# EAGLE design amiketo_2hm (EAGLE 7.2.0)
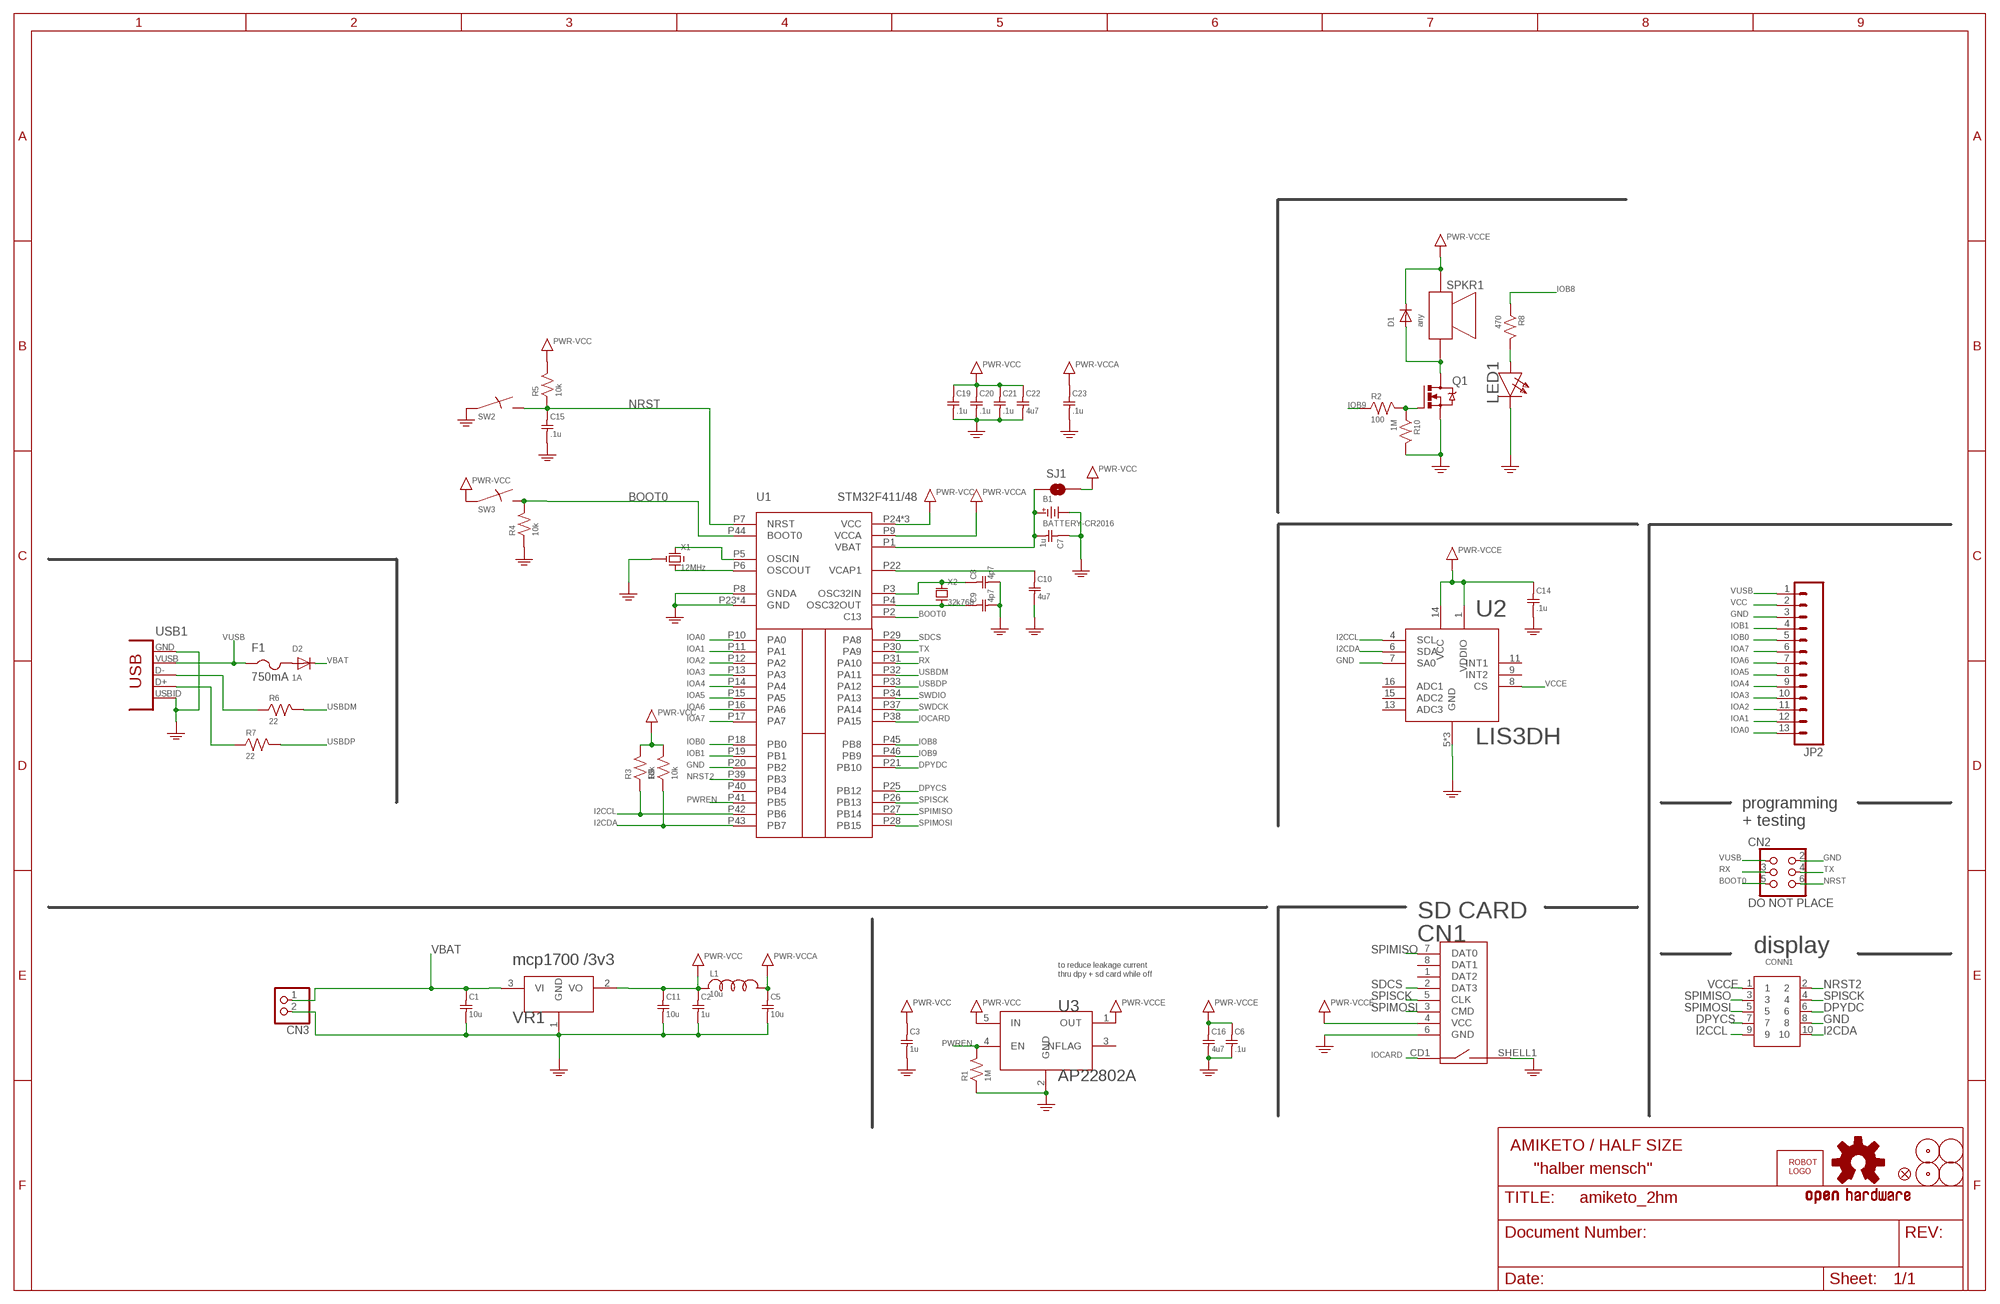
[diagram p0: schematic, sheet 1]

## Parts
B1  BATTERY-CR2016  [CR1216]
C1  10u  C0603  [SMD0603]
C2  1u  C0603  [SMD0603]
C3  1u  C0603  [SMD0603]
C5  10u  C0603  [SMD0603]
C6  .1u  C0603  [SMD0603]
C7  1u  C0603  [SMD0603]
C8  4p7  C0603  [SMD0603]
C9  4p7  C0603  [SMD0603]
C10  4u7  C0603  [SMD0603]
C11  10u  C0603  [SMD0603]
C14  .1u  C0603  [SMD0603]
C15  .1u  C0603  [SMD0603]
C16  4u7  C0603  [SMD0603]
C19  .1u  C0603  [SMD0603]
C20  .1u  C0603  [SMD0603]
C21  .1u  C0603  [SMD0603]
C22  4u7  C0603  [SMD0603]
C23  .1u  C0603  [SMD0603]
CN1  MICROSD-EJECT  [MICROSD/EJECTOR]
CN2  DO NOT PLACE  HEADER-3X2-POGO  [HEADER-3X2-POGO]
CN3  JST_2PIN-SMT-RA  [JST-PH-2-SMT-RA]
CONN1  HEADER-5X2-PTH  [HEADER-5X2-PTH]
D1  any  DIODE-0805  [SMD0805D]
D2  1A  DIODE-0805  [SMD0805D]
F1  750mA  FUSE  [SMD1206]
JP2  M13  [1X13]
L1  10u  LSMD0603  [SMD0603]
LED1  white  LED  [SMD0603D]
LOGO1  OSHW-LOGOM  [OSHW-LOGO-M]
Q1  IRLML6344TRPBF  MOSFETSOT-23  [SOT-23]
R1  1M  R0603  [SMD0603]
R2  100  R0603  [SMD0603]
R3  10k  R0603  [SMD0603]
R4  10k  R0603  [SMD0603]
R5  10k  R0603  [SMD0603]
R6  22  R0603  [SMD0603]
R7  22  R0603  [SMD0603]
R8  470  R0603  [SMD0603]
R9  10k  R0603  [SMD0603]
R10  1M  R0603  [SMD0603]
SJ1  JUMPER-PAD-2-NOYES_SILK  [PAD-JUMPER-2-NO_YES_SILK]
SPKR1  PUI-5040  [PUI-0540]
SW2  SWITCHKMR211  [KMR211]
SW3  SWITCHKMR211  [KMR211]
U1  STM32F411/48  [UQPFN48]
U2  LIS3DH  [LGA16A]
U3  AP22802A  NCP380  [SOT-23-5]
U$1  FIDUCIAL  [FIDUCIAL]
U$2  FIDUCIAL  [FIDUCIAL_1MM]
U$3  FIDUCIAL  [FIDUCIAL_1MM]
U$4  ROBOTMAN-LOGO2  [ROBOTMAN-LOGO2]
U$5  FIDUCIAL  [FIDUCIAL]
U$6  FIDUCIALUFIDUCIAL  [MICRO-FIDUCIAL]
USB1  CON-USB-F-MICRO-B  [CONN_USB_MICRO-B]
VR1  mcp1700 /3v3  REGULATOR-SOT23-3  [SOT-23-3]
X1  12MHz  RESONATORCTCE  [RESONATOR-CSTCE]
X2  32k768  XTAL32X15  [XTAL-32X15]

## Nets
BOOT0: CN2.5 R4.2 SW3.2 SW3.4 U1.P2(C13) U1.P44(BOOT0)
DPYCS: CONN1.7 U1.P25(PB12)
DPYDC: CONN1.6 U1.P21(PB10)
GND: B1.MINUS(M) C1.2 C2.2 C3.2 C5.2 C6.2 C7.1 C8.2 C9.2 C10.2 C11.2 C14.2 C15.2 C16.2 C19.2 C20.2 C21.2 C22.2 C23.2 CN1.6(GND) CN1.SHELL1(SW2) CN2.2 CN3.2 CONN1.8 JP2.3 LED1.C Q1.2(S) R1.1 R4.1 R10.2 SW2.1 SW2.3 U1.P8(GNDA) U1.P20(PB2) U1.P23(GND) U1.P35(GND) U1.P47(GND) U1.PAD(GND) U2.5(GND) U2.7(SA0) U2.10(GND) U2.12(GND) U3.2(GND) USB1.P4(USBID) USB1.P5(GND) VR1.1(GND) X1.2(G) ; supply symbol labelled PWR-GND
I2CCL: CONN1.9 R3.1 U1.P42(PB6) U2.4(SCL)
I2CDA: CONN1.10 R9.1 U1.P43(PB7) U2.6(SDA)
IOA0: JP2.13 U1.P10(PA0)
IOA1: JP2.12 U1.P11(PA1)
IOA2: JP2.11 U1.P12(PA2)
IOA3: JP2.10 U1.P13(PA3)
IOA4: JP2.9 U1.P14(PA4)
IOA5: JP2.8 U1.P15(PA5)
IOA6: JP2.7 U1.P16(PA6)
IOA7: JP2.6 U1.P17(PA7)
IOB0: JP2.5 U1.P18(PB0)
IOB1: JP2.4 U1.P19(PB1)
IOB8: R8.1 U1.P45(PB8)
IOB9: R2.1 U1.P46(PB9)
IOCARD: CN1.CD1(SW1) U1.P38(PA15)
N$7: R6.1 USB1.P2(D-)
N$8: R7.1 USB1.P3(D+)
N$9: Q1.1(G) R2.2 R10.1
N$11: LED1.A R8.2
N$12: U1.P5(OSCIN) X1.1(X1)
N$13: U1.P6(OSCOUT) X1.3(X2)
N$14: D1.A Q1.3(D) SPKR1.P2
N$15: C8.1 U1.P3(OSC32IN) X2.P$1
N$16: C9.1 U1.P4(OSC32OUT) X2.P$2
N$18: C10.1 U1.P22(VCAP1)
N$21: B1.PLUS1(P) B1.PLUS2(P) C7.2 SJ1.1 U1.P1(VBAT)
N$24: D2.A F1.2
NRST: C15.1 CN2.6 R5.1 SW2.2 SW2.4 U1.P7(NRST)
NRST2: CONN1.2 U1.P39(PB3)
PWREN: R1.2 U1.P41(PB5) U3.4(EN)
RX: CN2.3 U1.P31(PA10)
SDCS: CN1.2(DAT3) U1.P29(PA8)
SPIMISO: CN1.7(DAT0) CONN1.3 U1.P27(PB14)
SPIMOSI: CN1.3(CMD) CONN1.5 U1.P28(PB15)
SPISCK: CN1.5(CLK) CONN1.4 U1.P26(PB13)
SWDCK: U1.P37(PA14)
SWDIO: U1.P34(PA13)
TX: CN2.4 U1.P30(PA9)
USBDM: R6.2 U1.P32(PA11)
USBDP: R7.2 U1.P33(PA12)
VBAT: C1.1 CN3.1 D2.C VR1.3(VI)
VCC: C2.1 C3.1 C11.1 C19.1 C20.1 C21.1 C22.1 JP2.2 L1.1 R3.2 R5.2 R9.2 SJ1.2 SW3.1 SW3.3 U1.P24(VCC) U1.P36(VCC) U1.P48(VCC) U3.5(IN) VR1.2(VO) ; supply symbol labelled PWR-VCC
VCCA: C5.1 C23.1 L1.2 U1.P9(VCCA) ; supply symbol labelled PWR-VCCA
VCCE: C6.1 C14.1 C16.1 CN1.4(VCC) CONN1.1 D1.C SPKR1.P1 U2.1(VDDIO) U2.8(CS) U2.14(VCC) U3.1(OUT) ; supply symbol labelled PWR-VCCE
VUSB: CN2.1 F1.1 JP2.1 USB1.P1(VUSB)
Unconnected: CN1.1(DAT2) CN1.8(DAT1) U1.P40(PB4) U2.9(INT2) U2.11(INT1) U2.13(ADC3) U2.15(ADC2) U2.16(ADC1) U3.3(NFLAG) USB1.BODY@1(BODY) USB1.BODY@2(BODY) USB1.BODY@3(BODY) USB1.BODY@4(BODY)

## Notes on the sheet
- programming
  + testing
- SD CARD
- display
- to reduce leakage current
  thru dpy + sd card while off
- AMIKETO / HALF SIZE
- "halber mensch"

## Library data of the parts
B1 = jaw:BATTERY
C1-C3 C5-C11 C14-C16 C19-C23 = jaw:C
CN1 = jaw:MICROSD
CN2 = jaw:HEADER-3X2
CN3 = adafruit:JST_2PIN: JST 2-Pin Connectors of various flavors SMT-RA (S2B-PH-SM4) 4UConnector #17311 SMT (B2B-PH-SM4) THM-RA (S2B-PH) THM (B2B-PH)
CONN1 = jaw:HEADER-5X2
D1 D2 = jaw:DIODE
F1 = jaw:FUSE
JP2 = SparkFun-Connectors:M13: 13-pin single row .1" header
L1 = jaw:L
LED1 = jaw:LED
LOGO1 = Sparkfun-Aesthetics:OSHW-LOGO: Open Source Hardware Logo This logo indicates the piece of hardware it is found on incorporates a OSHW license and/or adheres to the definition of open source hardware found here: http://freedomdefined.org/OSHW
Q1 = jaw:MOSFET
R1-R10 = jaw:R
SJ1 = SparkFun-Passives:JUMPER-PAD-2-NO
SPKR1 = jaw:PUI-5040
SW2 SW3 = jaw:SWITCH
U1 = jaw:STM32F411/48
U2 = jaw:LIS3DH
U3 = jaw:NCP380
U$1 U$5 = jaw:FIDUCIAL
U$2 U$3 = adafruit:FIDUCIAL: For use by pick and place machines to calibrate the vision/machine, 1mm By microbuilder.eu
U$4 = jaw:ROBOTMAN-LOGO
U$6 = Sparkfun-Aesthetics:FIDUCIAL: Fiducial Alignment Points Various fiducial points for machine vision alignment.
USB1 = dp_devices:CON-USB-F: USB Female connector
VR1 = jaw:REGULATOR
X1 = jaw:RESONATOR
X2 = jaw:XTAL

## Board
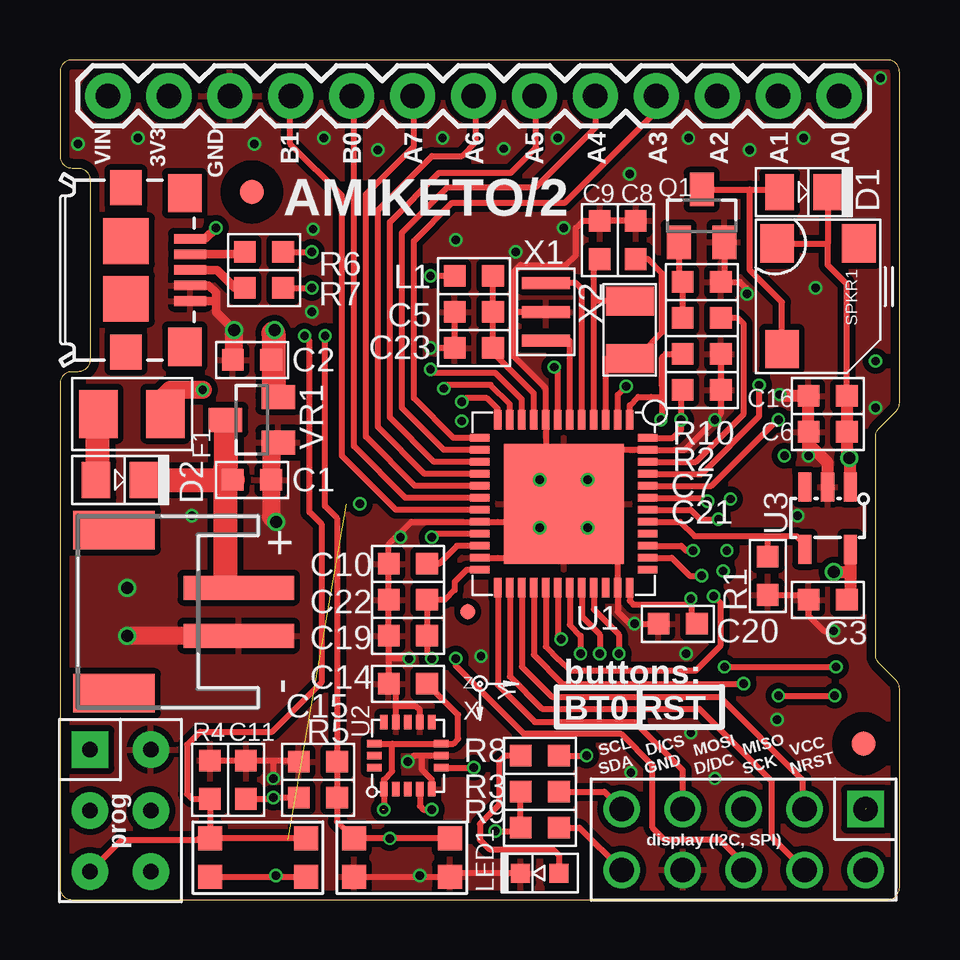
[diagram p1: board, top side]
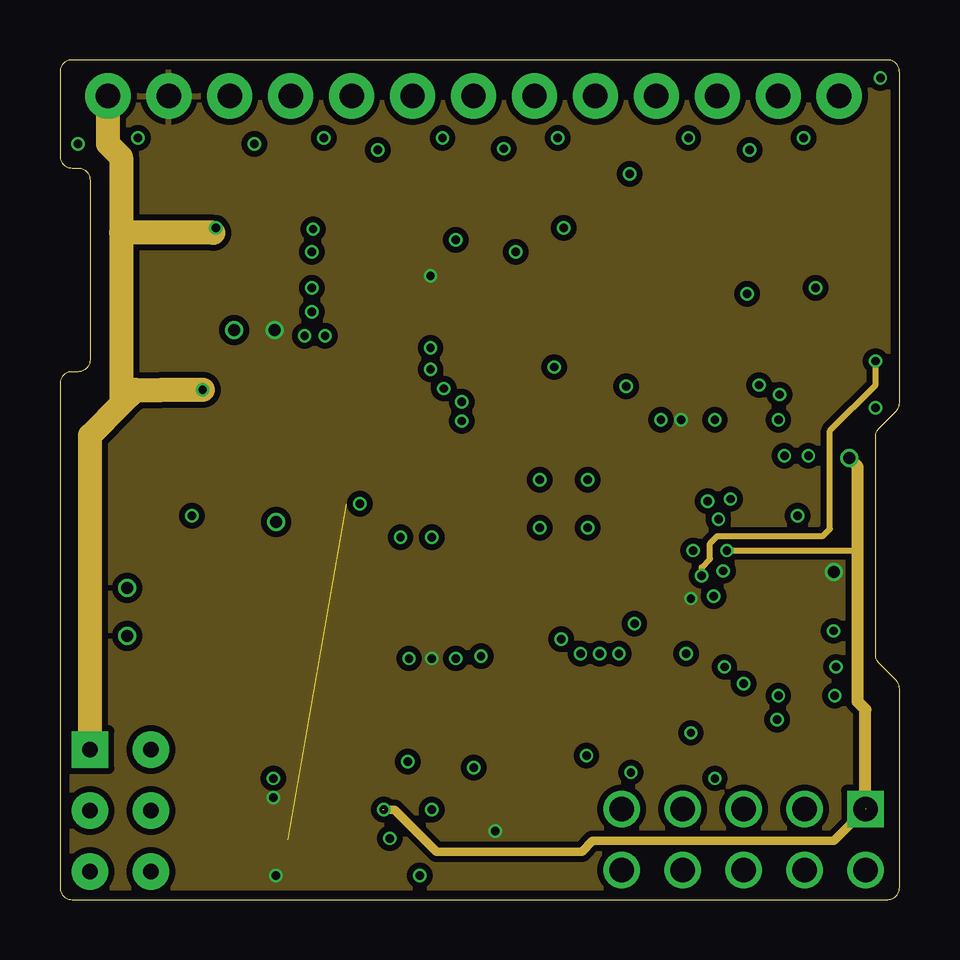
[diagram p2: board, inner layer Route2]
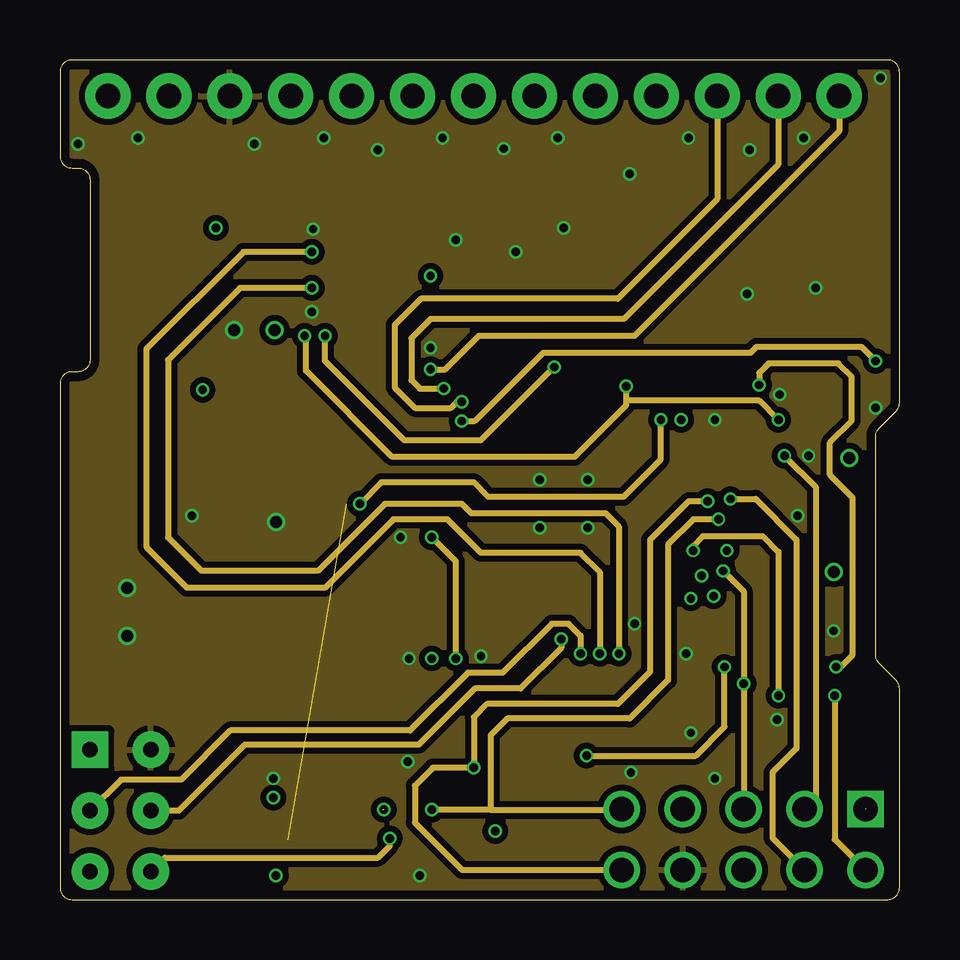
[diagram p3: board, inner layer Route15]
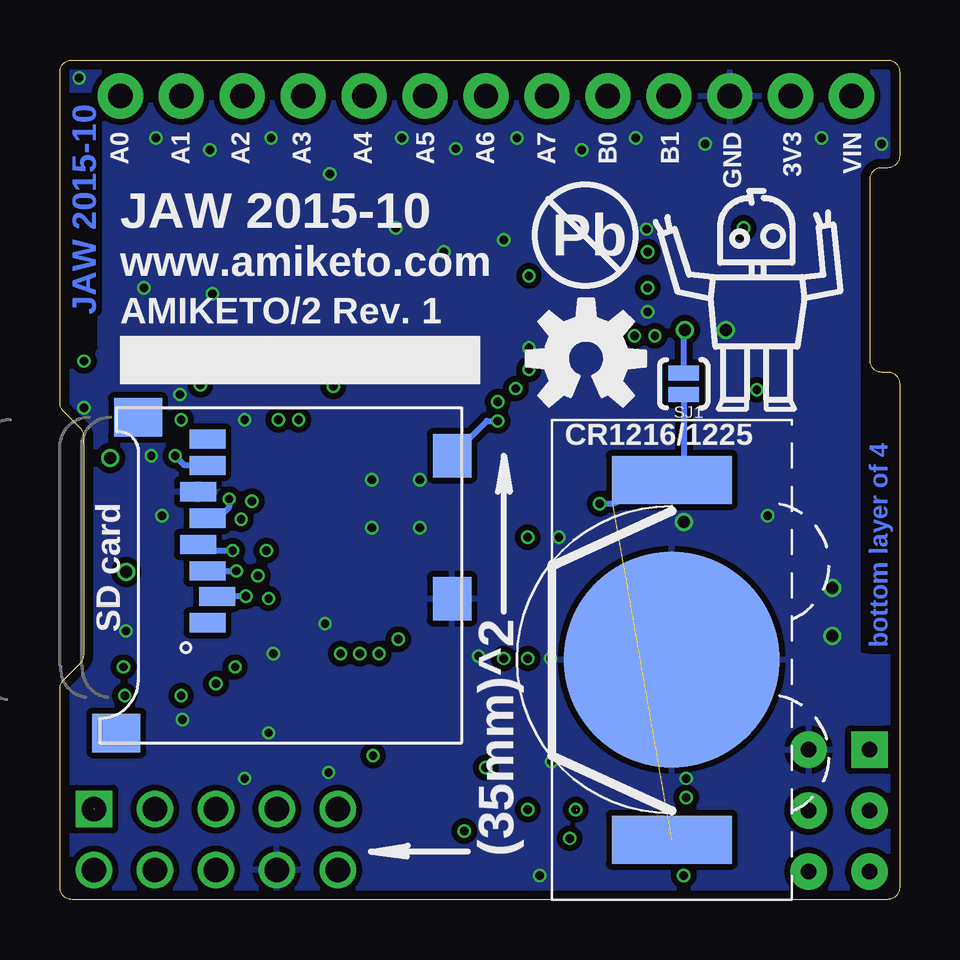
[diagram p4: board, bottom side, seen from below]

Size 35 x 35 mm. Coordinates in mm from the lower left corner, seen from the top.
Outline: 0,21.5 0,0.5 arc90 0.5,0 34.5,0 arc90 35,0.5 35,8.79 arc45 34.85,9.15 34.15,9.85 arc-45 34,10.21 34,19.29 arc-45 34.15,19.65 34.85,20.35 arc45 35,20.71 35,34.5 arc90 34.5,35 0.5,35 arc90 0,34.5 0,31 arc90 0.5,30.5 0.75,30.5 arc-90 1.25,30 1.25,22.5 arc-90 0.75,22 0.5,22 arc90 0,21.5
Copper layers (1*2*15*16): Top 0.035559375mm / dielectric 0.17018125mm / Route2 0.01778125mm / dielectric 47mil / Route15 0.01778125mm / dielectric 0.17018125mm / Bottom 0.035559375mm
Design rules "OSHPark-4layer *": minimum track width 5mil, minimum drill 10mil, track to track 5mil, track to pad 5mil, pad to pad 5mil, via to via 5mil, smd to smd 5mil, copper to edge 15mil, drill to drill 6mil, minimum pad ring 4mil, minimum via ring 4mil, stop-mask expansion 4mil, vias tented up to drill 0.5mm, thermal gap 10mil

### Footprints (pad centres in the part's own frame; a part is rotated, then mirrored left to right if it is on the bottom)
CR1216 = smd 9 x 9: MINUS 0,0 | smd 2 x 5: PLUS1 -7.5,0; PLUS2 7.5,0
SMD0603 = smd 0.9 x 0.9: 1 -0.8,0; 2 0.8,0
MICROSD/EJECTOR = smd 0.8 x 1.5: 1 1.96,-3.1; 2 0.86,-2.7; 3 -0.2,-3.1; 4 -1.3,-3.5; 5 -2.4,-3.1; 6 -3.5,-3.5; 7 -4.6,-3.1; 8 -5.7,-3.1 | smd 1.8 x 1.6: CD1 -5,7.1; SHELL1 0.96,7.1 | smd 1.6 x 2: SHELL2 -6.6,-6; SHELL3 6.56,-6.9
HEADER-3X2-POGO = drill 0.635 pad 1.524 square: 1 0,0 | drill 0.635 pad 1.524: 2 0,2.54; 3 2.54,0; 4 2.54,2.54; 5 5.08,0; 6 5.08,2.54
JST-PH-2-SMT-RA = smd 1 x 4.6: 1 1,-3.7; 2 -1,-3.7 | smd 1.6 x 3.4: NC1 -3.4,1.5; NC2 3.4,1.5
HEADER-5X2-PTH = drill 1.016 square: 1 -5.08,-1.27 | drill 1.016: 2 -5.08,1.27; 3 -2.54,-1.27; 4 -2.54,1.27; 5 0,-1.27; 6 0,1.27; 7 2.54,-1.27; 8 2.54,1.27; 9 5.08,-1.27; 10 5.08,1.27
SMD0805D = smd 1.2 x 1.5: A 1,0; C -1,0
SMD1206 = smd 1.6 x 2: 1 -1.4,0; 2 1.4,0
1X13 = drill 1.016 pad 1.88: 1 0,0; 2 2.54,0; 3 5.08,0; 4 7.62,0; 5 10.16,0; 6 12.7,0; 7 15.24,0; 8 17.78,0; 9 20.32,0; 10 22.86,0; 11 25.4,0; 12 27.94,0; 13 30.48,0
SMD0603D = smd 0.8 x 0.8: A -0.8,0; C 0.8,0
SOT-23 = smd 1 x 1.4: 1 -0.95,-1.1; 2 0.95,-1.1; 3 0,1.1
PAD-JUMPER-2-NO_YES_SILK = smd 0.635 x 1.27: 1 -0.45,0; 2 0.45,0
PUI-0540 = smd 1.4 x 1.6: NC 1.8,2.2; P1 -1.6,2.2; P2 -1.4,-2.2
KMR211 = smd 1 x 1: 1 -2,0.8; 2 -2,-0.8; 3 2,0.8; 4 2,-0.8
UQPFN48 = smd 0.3 x 0.8: P1 -2.75,-3.5; P2 -2.25,-3.5; P3 -1.75,-3.5; P4 -1.25,-3.5; P5 -0.75,-3.5; P6 -0.25,-3.5; P7 0.25,-3.5; P8 0.75,-3.5; P9 1.25,-3.5; P10 1.75,-3.5; P11 2.25,-3.5; P12 2.75,-3.5; P25 2.75,3.5; P26 2.25,3.5; P27 1.75,3.5; P28 1.25,3.5; P29 0.75,3.5; P30 0.25,3.5; P31 -0.25,3.5; P32 -0.75,3.5; P33 -1.25,3.5; P34 -1.75,3.5; P35 -2.25,3.5; P36 -2.75,3.5 | smd 0.8 x 0.3: P13 3.5,-2.75; P14 3.5,-2.25; P15 3.5,-1.75; P16 3.5,-1.25; P17 3.5,-0.75; P18 3.5,-0.25; P19 3.5,0.25; P20 3.5,0.75; P21 3.5,1.25; P22 3.5,1.75; P23 3.5,2.25; P24 3.5,2.75; P37 -3.5,2.75; P38 -3.5,2.25; P39 -3.5,1.75; P40 -3.5,1.25; P41 -3.5,0.75; P42 -3.5,0.25; P43 -3.5,-0.25; P44 -3.5,-0.75; P45 -3.5,-1.25; P46 -3.5,-1.75; P47 -3.5,-2.25; P48 -3.5,-2.75 | smd 5 x 5: PAD 0,0
LGA16A = smd 0.3 x 0.6: 1 -1,-1.4; 2 -0.5,-1.4; 3 0,-1.4; 4 0.5,-1.4; 5 1,-1.4; 9 1,1.4; 10 0.5,1.4; 11 0,1.4; 12 -0.5,1.4; 13 -1,1.4 | smd 0.6 x 0.3: 6 1.4,-0.5; 7 1.4,0; 8 1.4,0.5; 14 -1.4,0.5; 15 -1.4,0; 16 -1.4,-0.5
SOT-23-5 = smd 1.2 x 0.55: 1 -1.2,0.95; 2 -1.2,0; 3 -1.2,-0.95; 4 1.4,-0.95; 5 1.4,0.95
FIDUCIAL_1MM = smd 1 x 1: 1 0,0
MICRO-FIDUCIAL = smd 0.635 x 0.635: 1 0,0
CONN_USB_MICRO-B = smd 1.6 x 1.4: BODY@1 -3.2,2.45; BODY@2 3.2,2.45 | smd 1.45 x 1.3: BODY@3 3.425,0; BODY@6 -3.425,0 | smd 1.9 x 1.9: BODY@4 1.2,0; BODY@5 -1.2,0 | smd 0.4 x 1.35: P1 -1.3,2.675; P2 -0.65,2.675; P3 0,2.675; P4 0.65,2.675; P5 1.3,2.675
SOT-23-3 = smd 1 x 1.4: 1 -0.95,-1.1; 2 0.95,-1.1; 3 0,1.1
RESONATOR-CSTCE = smd 0.5 x 2: 1 -1.2,0; 2 0,0; 3 1.2,0
XTAL-32X15 = smd 1.2 x 2: P$1 -1.2,0; P$2 1.2,0

### Placement (x,y rotation side)
B1  9.5,10 270 bottom
C1  8,17.5 0 top
C2  8,22.5 180 top
C3  32,12.5 180 top
C5  17.25,24.5 180 top
C6  32,19.5 180 top
C7  26.75,22.75 180 top
C8  24,27.5 90 top
C9  22.5,27.5 90 top
C10  14.5,14 180 top
C11  7.75,5 90 top
C14  14.5,9 180 top
C15  10.75,5.75 180 top
C16  32,21 180 top
C19  14.5,11 180 top
C20  25.75,11.5 180 top
C21  26.75,21.25 0 top
C22  14.5,12.5 180 top
C23  17.25,23 180 top
CN1  25.75,13.5 270 bottom
CN2  1.25,6.25 270 top
CN3  3.75,12 90 top
CONN1  28.5,2.5 180 top
D1  31,29.5 180 top
D2  2.5,17.5 180 top
F1  3,20.25 180 top
JP2  2,33.5 0 top
L1  17.25,26 0 top
LED1  20,1.1 180 top
LOGO1  13.07,22.55 0 bottom
Q1  26.75,28.5 0 top
R1  29.5,13.5 90 top
R2  26.75,24.25 180 top
R3  20,4.5 180 top
R4  6.25,5 270 top
R5  10.75,4.25 180 top
R6  8.5,27 0 top
R7  8.5,25.5 0 top
R8  20,6 180 top
R9  20,3 180 top
R10  26.75,25.75 0 top
SJ1  9,21.5 90 bottom
SPKR1  31.5,25.15 0 top
SW2  14.25,1.75 180 top
SW3  8.25,1.75 180 top
U1  21,16.5 180 top
U2  14.5,6 0 top
U3  32,16 270 top
U$1  1.25,8.75 0 bottom
U$2  33.5,6.5 0 top
U$3  8,29.5 0 top
U$4  5.97,24.85 0 bottom
U$5  21,16.5 0 bottom
U$6  17,12 0 top
USB1  2.75,26.25 270 top
VR1  8,20 90 top
X1  20.25,24.5 270 top
X2  23.75,23.75 90 top

### Tracks (layer width: path | path; a pad name or v marks a point on that pad's centre or on a via)
BOOT0  (via drill 0.35)
  Top 0.25: SW3.4 SW3.2 10.25,2.5 | SW3.4 R4.2 5.5,4.2 5.3,4.4 5.3,6.45 5.85,7 8.85,7 10.9,9.05 10.9,15.65 10.4,16.15 10.4,23.3 v10.2,23.5 | CN2.5 2.58,2.5 5.75,2.5 5.8,2.55 SW3.4 | U1.P2 23.25,21.05 v23.6,21.4 | U1.P44 27.15,17.25 29.9,20 v29.95,20
  Route15 0.25: v29.95,20 29.15,20.8 23.6,20.8 | v23.6,21.4 23.6,20.8 | 23.6,20.8 23.6,20.6 21.45,18.45 13.85,18.45 10.25,22.05 10.25,23.45 v10.2,23.5
DPYCS
  Top 0.25: U1.P25 18.25,8.95 19.8,7.4 23.95,7.4 25.95,5.4 CONN1.7
DPYDC  (via drill 0.35)
  Top 0.25: U1.P21 15.65,15.25 v15.5,15.1 | CONN1.6 28.5,1.5 27.5,2.5 25.2,2.5 24.7,3 24.7,5.6 23.4,6.9 19.35,6.9 16.5,9.75 v16.5,10.05
  Route15 0.25: v16.5,10.05 16.5,14.1 v15.5,15.1
GND  (via drill 0.35, 0.5)
  Top 0.25: SW2.3 15,0.95 | 15,0.95 SW2.1 16.4,1.1 LED1.C | v15,1 15,0.95 | R4.1 C11.2 8.9,5.8 | 21.38,16.12 23.25,14.25 U1.P35 23.25,12 23.75,11.5 v23.95,11.5 C20.2 | 21.38,16.12 U1.PAD | U1.PAD 23.25,18.75 U1.P47 26.05,18.75 v27.3,20 27.55,20.25 C21.2 C7.1 | 20.62,16.88 20.25,17.25 U1.P8 20.25,21.3 18.9,22.65 18.9,24.5 | 20.62,16.88 U1.PAD | 20.62,16.88 19.5,15.75 U1.P20 14.65,15.75 13.7,14.8 C10.2 C22.2 C19.2 13.7,10.05 | U1.P23 19.5,14.25 21.38,16.12 | C8.2 C9.2 21.8,28.3 21.5,28 21.5,26.85 21.1,26.45 19.2,26.45 18.9,26.15 18.9,24.5 | 18.9,24.5 18.9,24.35 18.9,24.5 | C5.2 C23.2 15.6,23 v15.45,23 | X1.2 18.9,24.5 | 8.9,5.8 9.9,5.8 C15.2 | v8.9,5.05 8.9,5.8 | Q1.2 27.7,25.75 | 27.7,25.75 R10.2 | R10.2 27.7,25.75 | R10.2 27.7,25.75 | 27.7,25.75 28.35,25.75 28.6,25.5 28.6,25.25 v28.65,25.25 | U2.7 15.1,6 | 15.1,6 14.75,6 v14.5,5.75 | U2.5 15.5,5 15.1,5.4 15.1,6 | U2.12 14,8.1 | 14,8.1 14,9 C14.2 13.7,10.05 | U2.10 15,7.9 14.85,8.05 14.05,8.05 14,8.1 | v14.55,10.05 13.7,10.05 | v32.25,11.2 31.85,11.2 31.2,11.85 C3.2 31,12.7 R1.1
  Top 0.35: USB1.P4 6.2,25.6 6.5,25.3 6.5,25 | 6.5,25 6.5,24.5 v7.25,23.75 | USB1.P5 6.45,24.95 6.5,25
  Top 0.5: 9.15,19 VR1.1 8.8,18.75 | C2.2 7.25,22.55 | v30,21.05 30.15,21 C16.2 C6.2 31.2,19 | v31.2,18.5 31.2,19 | U3.2 32,17.7 32,18.2 31.2,19
  Top 0.75: CN3.2 v2.8,11 | 8.8,18.75 C1.2 8.8,15.95 v9,15.75 | 7.25,22.55 v7.25,23.75
  other vias: 22,17.5 22,15.5 20,15.5 3.25,31.75 11,31.75 13.25,31.25 26.2,31.75 16.5,27.5 10.55,27.95 10.5,24.5 21,28 23.75,30.25 31.5,25.5 29.9,7.5 27.3,5.05 26.3,6.95 23.8,5.3 8.1,31.5 18.5,31.3 28.75,31.25 17.55,10.15 34.2,34.25 31,31.75 15.95,31.75 20.75,31.75 20,17.5 19,27 14.2,15.1 2.8,13 5.5,16 30.75,16 26.1,10.25 34,20.5 0.75,31.5
  pour Route15 (isolate 0.25): -0.5,35.5 -0.5,-0.5 35.5,-0.5 35.5,35.5
  pour Bottom (isolate 0.25): -0.55,35.45 -0.55,-0.55 35.45,-0.55 35.45,35.45
  pour Top (isolate 0.25): -0.55,35.45 -0.55,-0.55 35.45,-0.55 35.45,35.45
I2CCL  (via drill 0.35)
  Top 0.25: U1.P42 26.3,16.25 26.7,15.85 v27.45,15.85 | R3.1 22.69,4.5 CONN1.9 | U2.4 15,3.9 15.15,3.75 v15.5,3.75
  Route15 0.25: v27.45,15.85 26.4,15.85 25.35,14.8 25.35,9.15 23.75,7.55 18.65,7.55 17.95,6.85 17.95,3.75 | 17.95,3.75 v15.5,3.75 | 17.95,3.75 23.4,3.75 CONN1.9
I2CDA  (via drill 0.35)
  Top 0.25: U1.P43 26.85,16.75 v27,16.6 | R9.1 21.65,3 CONN1.10 | U2.6 v17.25,5.5
  Route15 0.25: 23.39,1.2 CONN1.10 16.77,1.23 14.8,3.2 14.8,4.75 15.55,5.5 v17.25,5.5 17.25,7.6 17.8,8.15 23.25,8.15 24.6,9.5 24.6,15 26.2,16.6 v27,16.6
IOA0  (via drill 0.35)
  Top 0.25: U1.P10 19.25,20.85 18.15,21.95 15.6,21.95 v15.45,22.1
  Route15 0.25: JP2.13 32.48,32.03 23.95,23.5 17.45,23.5 16.05,22.1 v15.45,22.1
IOA1  (via drill 0.35)
  Top 0.25: U1.P11 18.75,20.65 17.95,21.45 16.15,21.45 v16,21.3
  Route15 0.25: JP2.12 29.94,30.64 23.5,24.2 15.45,24.2 14.65,23.4 14.65,21.65 15,21.3 v16,21.3
IOA2  (via drill 0.35)
  Top 0.25: U1.P12 18.25,20.45 17.8,20.9 16.9,20.9 v16.75,20.75
  Route15 0.25: JP2.11 27.4,29.2 23.25,25.05 15.05,25.05 13.95,23.95 13.95,21.35 14.8,20.5 16.3,20.5 16.55,20.75 v16.75,20.75
IOA3
  Top 0.25: U1.P13 16.4,19.25 14.75,20.9 14.75,27.45 16.35,29.05 21.05,29.05 24.86,32.86 JP2.10
IOA4
  Top 0.25: U1.P14 16,18.75 14.25,20.5 14.25,27.8 16.15,29.7 19.85,29.7 22.35,32.2 22.35,33.47 JP2.9
IOA5
  Top 0.25: U1.P15 15.6,18.25 13.75,20.1 13.75,28.25 15.8,30.3 18.8,30.3 19.85,31.35 19.85,33.43 JP2.8
IOA6
  Top 0.25: U1.P16 15.2,17.75 13.25,19.7 13.25,28.75 15.5,31 16.75,31 17.35,31.6 17.35,33.39 JP2.7
IOA7
  Top 0.25: U1.P17 14.8,17.25 12.75,19.3 12.75,29.4 14.75,31.4 14.75,33.45 JP2.6
IOB0
  Top 0.25: U1.P18 14.4,16.75 12.25,18.9 12.25,33.4 JP2.5
IOB1
  Top 0.25: U1.P19 14,16.25 11.75,18.5 11.75,29.35 9.6,31.5 9.6,33.48 JP2.4
IOB8  (via drill 0.35)
  Top 0.25: R8.1 20.9,6 v21.95,6 | U1.P45 26.75,17.75 29.15,20.15 v29.15,21.45 | v27.7,9.7 v32.35,9.7
  Route15 0.25: v21.95,6 26.5,6 27.7,7.2 v27.7,9.7 | v32.35,9.7 32.55,9.7 33.05,10.2 33.05,16.75 32.1,17.7 32.1,19.05 33,19.95 33,21.8 32.45,22.35 29.55,22.35 29.15,21.95 29.15,21.5 v29.15,21.45
IOB9
  Top 0.25: U1.P46 26.5,18.25 28.5,20.25 28.5,24 28.25,24.25 R2.1
IOCARD  (via drill 0.35)
  Top 0.25: U1.P38 25.5,14.25 26.25,13.5 v26.75,13.5
  Route2 0.25: v26.75,13.5 26.75,13.85 27.1,14.2 27.1,14.85 27.4,15.15 31.8,15.15 32.1,15.45 32.1,19.55 34,21.45 v34,22.45
  Route15 0.25: v16.75,19.95 17.3,19.95 20.15,22.8 28.8,22.8 29.05,23.05 33.4,23.05 v34,22.45
  Bottom 0.25: CN1.CD1 17.2,19.95 v16.75,19.95
N$2
  cutout Bottom: 0,22 0,10.4 1.5,10.4 1.5,22
N$3
  cutout Bottom: 35.5,33.5 35.5,23 33.55,23 33.55,33.5
N$7
  Top 0.35: USB1.P2 7.65,26.9 R6.1
N$8
  Top 0.35: USB1.P3 6.55,26.25 7.3,25.5 R7.1
N$9
  Top 0.25: Q1.1 25.8,25.75 R10.1 R2.2
N$11
  Top 0.25: R8.2 18.55,6 18.3,5.75 18.3,3.95 17.5,3.15 17.5,2.5 17.9,2.1 20.55,2.1 20.8,1.85 LED1.A
N$12
  Top 0.25: X1.1 21.5,25.7 21.75,25.45 U1.P5
N$13
  Top 0.25: U1.P6 21.25,21.05 21.25,23.3 X1.3
N$14
  Top 0.25: Q1.3 28.75,29.6 | 28.75,29.6 30.05,29.6 D1.A | SPKR1.P2 30.1,24.9 28.75,26.25 28.75,29.6
N$15
  Top 0.25: U1.P3 22.75,22.55 X2.P$1 24,22.8 24.25,22.8 25.1,23.65 25.1,26.1 24.5,26.7 C8.1
N$16
  Top 0.25: U1.P4 22.25,24.95 | 22.25,24.95 22.25,25.05 22.25,24.95 | 22.25,24.95 22.25,26.7 C9.1 | X2.P$2 22.25,24.95
N$18
  Top 0.25: U1.P22 16.55,14.75 15.8,14 C10.1
N$21  (via drill 0.35)  (1 unrouted)
  Top 0.25: U1.P1 23.75,20.6 24.1,20.95 24.65,20.95 25.05,20.95 25.1,21 | C7.2 25.25,22.75 25.1,22.6 25.1,21.4 25.1,21 | 25.1,21 25.1,20.05 v25.05,20
  Route15 0.25: v12.5,16.5 13.4,17.4 17.25,17.4 17.85,16.8 23.5,16.8 25.05,18.35 v25.05,20
  Bottom 0.25: v12.5,16.5 11.95,16.5 B1.PLUS1 9,17.5 | SJ1.1 9,17.5 | 9,17.5 8,17.5 9,17.5
N$24
  Top 0.5: F1.2 1.55,20.2
  Top 1: 1.55,20.2 1.55,17.5 D2.A
NRST  (via drill 0.35)
  Top 0.25: SW2.2 v13.75,2.55 | v13.75,2.55 SW2.4 11.55,3.25 R5.1 C15.1 11.55,15.9 11.05,16.4 11.05,23.2 v11.05,23.5 | v13.75,2.55 13.8,2.6 | U1.P7 20.75,22.05 v20.6,22.2
  Route15 0.25: CN2.6 4.37,1.75 13.25,1.75 13.75,2.25 v13.75,2.55 | v11.05,23.5 11.05,22.45 14.35,19.15 17.55,19.15 v20.6,22.2
NRST2  (via drill 0.35)
  Top 0.25: v29.95,8.5 v32.3,8.5 | U1.P39 25.9,14.75 26.1,14.55 v26.4,14.55
  Route15 0.25: CONN1.2 32.3,2.51 v32.3,8.5 | v26.4,14.55 26.4,14.75 26.8,15.15 29.3,15.15 29.95,14.5 v29.95,8.5
PWREN
  Top 0.25: U1.P41 25.85,15.75 26.45,15.15 29.05,15.15 29.5,15.15 | 29.5,15.15 30.7,15.15 31.05,14.8 U3.4 | R1.2 29.5,15.15
RX  (via drill 0.35)
  Top 0.25: U1.P31 21.25,11.45 21.7,11 v21.7,10.25
  Route15 0.25: v21.7,10.25 21.7,11 21.2,11.5 20.5,11.5 18.45,9.45 17,9.45 14.6,7.05 7.1,7.05 5.05,5 2.55,5 CN2.3
SDCS  (via drill 0.35)
  Top 0.25: U1.P29 20.25,10.55 20.8,10 21.25,9.55 26.5,9.55 27.55,10.6 27.55,11.8 27.55,12.35 v27.25,12.65
  Bottom 0.25: CN1.2 v27.25,12.65
SPIMISO  (via drill 0.35)
  Top 0.25: U1.P27 19.25,9.7 20.5,8.45 27.5,8.45 30.95,5 30.95,3.86 CONN1.3
  Route15 0.25: v30.2,18.5 31.5,17.2 31.5,4.26 CONN1.3
  Bottom 0.25: CN1.7 29.8,18.1 v30.2,18.5
SPIMOSI  (via drill 0.35)
  Top 0.25: U1.P28 19.75,10.2 20.95,9 v28.5,9
  Route15 0.25: CONN1.5 28.5,4.07 v28.5,9 28.5,12.85 v27.65,13.7
  Bottom 0.25: CN1.3 v27.65,13.7
SPISCK  (via drill 0.35)
  Top 0.25: U1.P26 18.75,9.3 20.1,7.95 26.65,7.95 29.65,4.95 29.65,2.62 CONN1.4
  Route15 0.25: v27.95,16.7 29,16.7 30.7,15 30.7,6.3 29.7,5.3 29.7,2.57 CONN1.4
  Bottom 0.25: v27.95,16.7 27.95,16.35 28.25,16.05 28.7,16.05 CN1.5
TX  (via drill 0.35)
  Top 0.25: U1.P30 20.75,11 v20.9,10.85
  Route15 0.25: CN2.4 4.96,3.71 7.7,6.45 14.95,6.45 17.3,8.8 19.2,8.8 20.9,10.5 v20.9,10.85
USBDM  (via drill 0.35)
  Top 0.25: U1.P32 21.75,11.8 22.5,11.05 v22.5,10.25 | R6.2 v10.5,27
  Route15 0.25: v10.5,27 7.65,27 3.6,22.95 3.6,14.7 5.3,13 11.05,13 13.9,15.85 16.15,15.85 17.55,14.45 21.7,14.45 22.5,13.65 v22.5,10.25
USBDP  (via drill 0.35)
  Top 0.25: U1.P33 22.25,12.1 23.3,11.05 v23.3,10.25 | R7.2 v10.5,25.5
  Route15 0.25: v10.5,25.5 7.5,25.5 4.5,22.5 4.5,15.1 5.9,13.7 10.75,13.7 13.55,16.5 16.75,16.5 17.15,16.1 22.75,16.1 23.3,15.55 v23.3,10.25 23.3,10.2
VBAT
  Top 0.5: 6.9,18 6.9,17.8 C1.1 | CN3.1 6.9,13.55
  Top 1: D2.C C1.1 | VR1.3 6.9,18 6.9,13.55
VCC  (via drill 0.35, 0.5)
  Top 0.25: SW3.3 9,0.95 | 9,0.95 SW3.1 | v9,1 9,0.95 | C11.1 8.85,4.2 v8.9,4.25 R5.2 | U1.P24 16.95,13.75 16.45,13.25 16.45,12.9 16.05,12.5 C22.1 C19.1 15.3,10.25 v15.5,10.05 | U1.P36 23.75,12.45 23.9,12.3 26.3,12.3 v26.3,12.55 26.35,12.5 26.35,11.5 C20.1 | U1.P48 25.55,19.25 25.9,19.6 v25.9,20 25.9,21.2 C21.1 | L1.1 v15.45,26 | v18.15,2.85 19,2.85 19.05,2.85 R9.2 R3.2 | 9.15,23.6 8.9,23.6 | 8.9,23.6 8.9,23.7 | 8.9,23.7 8.9,23.95 | 8.9,23.6 8.9,23.7 | 8.9,23.7 v8.95,23.75
  Top 0.5: VR1.2 9.15,21 | 8.75,22.55 C2.1 8.9,23.6 | U3.5 32.95,13.65 | 32.95,13.65 32.95,12.5 C3.1 | v32.25,13.65 32.95,13.65
  Top 0.75: 8.9,23.7 8.75,22.55
  Top 1: 8.9,23.6 8.9,21 9.1,21 VR1.2
  Bottom 0.25: SJ1.2 9,23.15 9,23.7 v8.95,23.75
  pour Route2 (isolate 0.25): -0.5,35.5 -0.5,-0.5 35.5,-0.5 35.5,35.5
VCCA
  Top 0.25: C23.1 C5.1 L1.2 | 18.05,22.75 18.05,22.8 | 18.05,22.8 C23.1 | 18.15,23 C23.1 | U1.P9 19.75,21.1 18.05,22.8 | 18.05,22.8 C23.1
VCCE  (via drill 0.35, 0.5)  (2 unrouted)
  Top 0.25: U2.14 13.85,6.5 | 13.85,6.5 U2.8 16.4,6.5 16.6,6.7 16.6,7.7 C14.1 | 13.85,6.5 13.85,5.35 13.5,5 U2.1 v13.5,3.75 | D1.C 32,27.35 | C16.1 32.8,25.65 32,26.45 32,27.35 | SPKR1.P1 32,27.35
  Top 0.5: C16.1 C6.1 32.8,18.5 v32.9,18.4 32.95,18.35 U3.1
  Route2 0.25: v27.8,14.55 33.25,14.55
  Route2 0.35: 33.6,3.8 32.25,2.45 22.2,2.45 21.75,2 15.7,2 13.95,3.75 13.45,3.75
  Route2 0.5: CONN1.1 33.58,7.92 33.25,8.25 33.25,14.55 33.25,18.05 v32.9,18.4
  Bottom 0.25: CN1.4 29,14.55 v27.8,14.55
VUSB  (via drill 0.35)
  Top 0.35: USB1.P1 6.05,27.55 v6.5,28
  Top 0.5: 4,20.65 F1.1
  Top 0.75: v5.95,21.25 4.6,21.25 4,20.65
  Route2 0.5: 6.4,27.8 v6.5,28
  Route2 1: JP2.1 2,31.5 2.55,30.95 2.55,27.8 | CN2.1 1.25,19.25 1.25,19.35 2.55,20.65 | v5.95,21.25 4.25,21.25 3.15,21.25 2.55,20.65 | 2.55,27.8 2.55,20.65 | 6.4,27.8 2.55,27.8

### Text on the board
Bottom: JAW 2015-10 | bottom layer of 4
tPlace: VIN | 3V3 | GND | B1 | B0 | A7 | A6 | A5 | A4 | A3 | A2 | A1 | A0 | AMIKETO/2 | Z | X | Y | buttons: / BT0 RST | SCL | D/CS | MOSI | MISO | VCC | SDA | GND | D/DC | SCK | NRST | prog | display (I2C, SPI)
bPlace: VIN | 3V3 | GND | B1 | B0 | A7 | A6 | A5 | A4 | A3 | A2 | A1 | A0 | JAW 2015-10 | Pb | www.amiketo.com | AMIKETO/2 Rev. 1 | CR1216/1225 | SD card | (35mm)^2
tValues: L
bStop: JAW 2015-10